# Altium schematic sheet V1.0.SchDoc
size 88 x 50 mm
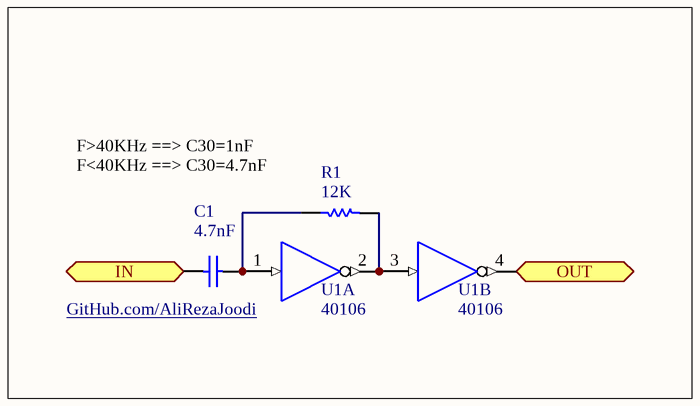
[diagram p0: V1.0.SchDoc]

## Parts
C1  value 4.7nF  [RESC3216N]  (hidden comment: Cap)
R1  value 12K  [0805]  (hidden comment: Res1)
U1  40106  [SOP127P636-14N]  (parts A,B of 7)

## Ports
IN (in), OUT (out)

## Nets
IN: C1.2 ; port IN
OUT: U1.4(~{O}) ; port OUT
NetC1_1: C1.1 R1.1 U1.1(I)
NetR1_2: R1.2 U1.2(~{O}) U1.3(I)

## Notes on the sheet
- F>40KHz ==> C30=1nF
  F<40KHz ==> C30=4.7nF
- GitHub.com/AliRezaJoodi

## Library data of the parts
C1 = Cap: Capacitor; Published: 8-Jun-2000; LatestRevisionDate: 17-Jul-2002; LatestRevisionNote: Re-released for DXP Platform.; PackageReference: RAD-0.3; Publisher: Altium Limited
R1 = Res1: Resistor; Published: 8-Jun-2000; LatestRevisionDate: 17-Jul-2002; LatestRevisionNote: Re-released for DXP Platform.; PackageReference: AXIAL-0.3; Publisher: Altium Limited
U1 = 40106: Hex inverting Schmitt trigger, 14-Pin; Publisher: Altium Limited; ComponentLink1URL: http://www.nxp.com